# EAGLE design shirasu (EAGLE 9.6.2)
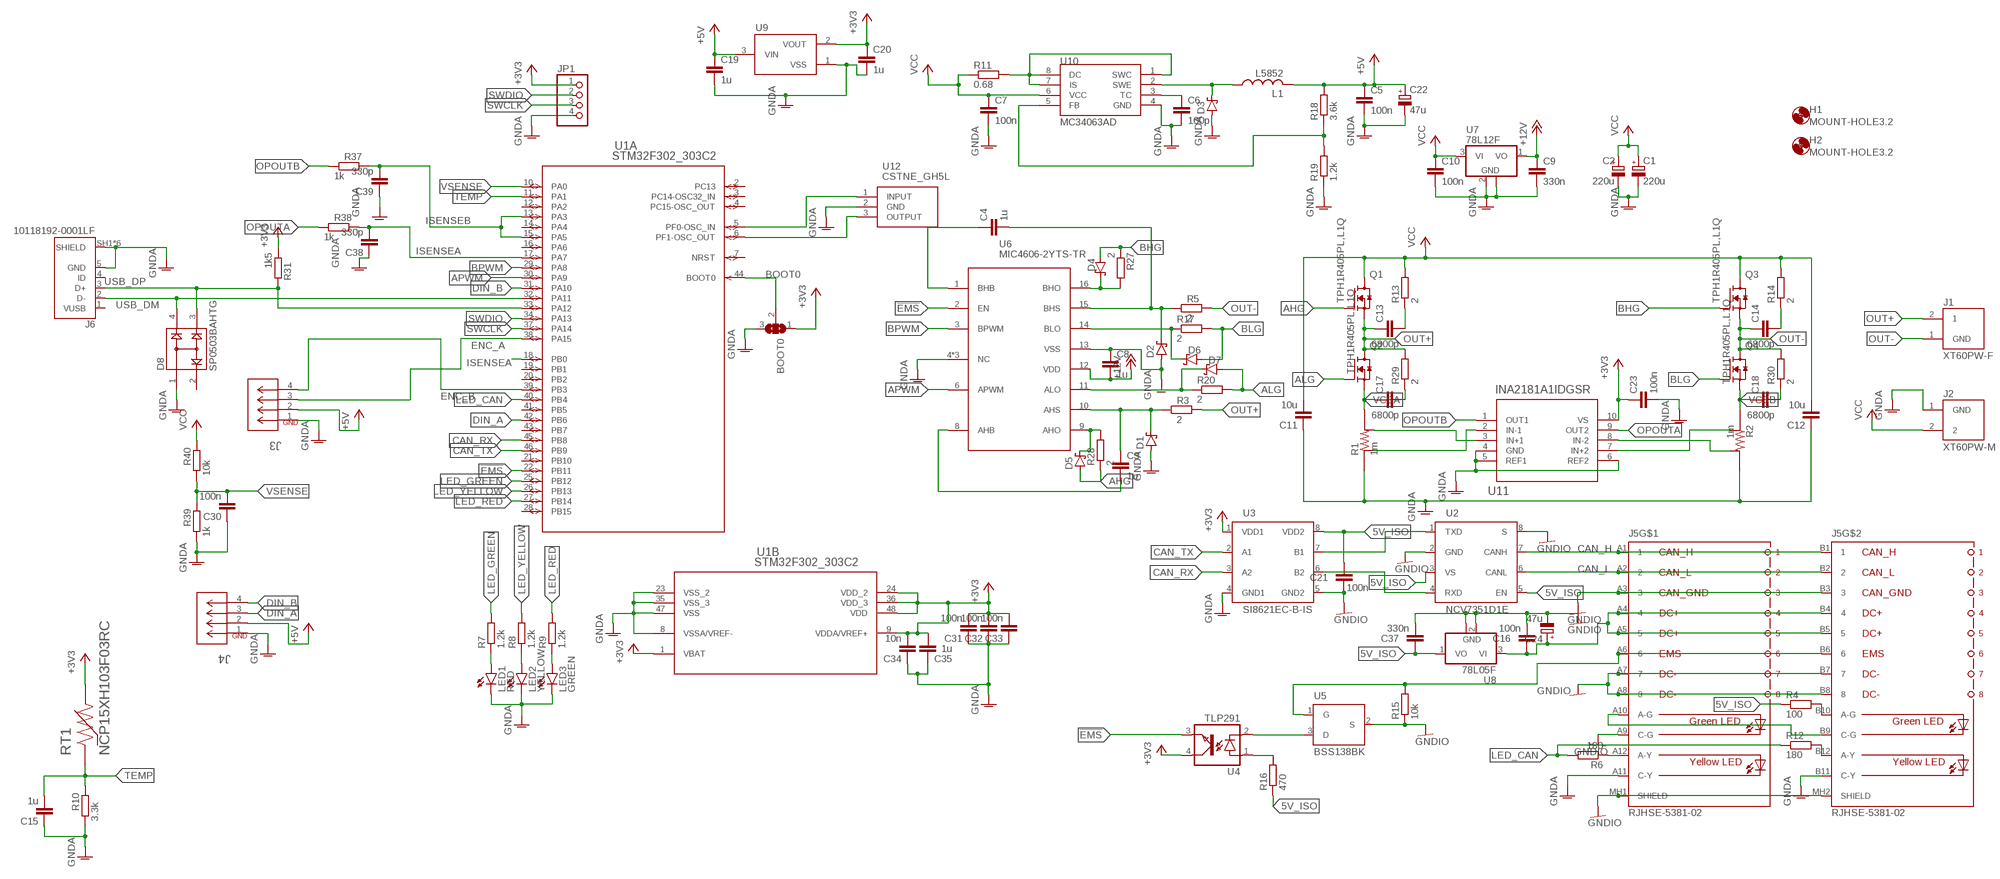
[diagram p0: schematic, sheet 1]

## Parts
BOOT0  SJ2W  [SJ_2]
C1  220u  CPOL-EUE5-10.5  [E5-10,5]
C2  220u  CPOL-EUE5-10.5  [E5-10,5]
C3  1u  C-EUC0603  [C0603]
C4  1u  C-EUC0603  [C0603]
C5  100n  C-EUC0603  [C0603]
C6  100p  C-EUC0603  [C0603]
C7  100n  C-EUC0603  [C0603]
C8  1u  C-EUC0603  [C0603]
C9  330n  C-EUC0603  [C0603]
C10  100n  C-EUC0603  [C0603]
C11  10u  C-EUC1210  [C1210]
C12  10u  C-EUC1210  [C1210]
C13  6800p  C-EUC0603  [C0603]
C14  6800p  C-EUC0603  [C0603]
C15  1u  C-EUC0603  [C0603]
C16  100n  C-EUC0603  [C0603]
C17  6800p  C-EUC0603  [C0603]
C18  6800p  C-EUC0603  [C0603]
C19  1u  C-EUC0603  [C0603]
C20  1u  C-EUC0603  [C0603]
C21  100n  C-EUC0603  [C0603]
C22  47u  CPOL-EUE2.5-5  [E2,5-5]
C23  100n  C-EUC0603  [C0603]
C24  47u  CPOL-EUE2.5-5  [E2,5-5]
C30  100n  C-EUC0603  [C0603]
C31  100n  C-EUC0603  [C0603]
C32  100n  C-EUC0603  [C0603]
C33  100n  C-EUC0603  [C0603]
C34  10n  C-EUC0603  [C0603]
C35  1u  C-EUC0603  [C0603]
C37  330n  C-EUC0603  [C0603]
C38  330p  C-EUC0603  [C0603]
C39  330p  C-EUC0603  [C0603]
D1  PMEG6010CEJ,115  [SOD323_ST]
D2  PMEG6010CEJ,115  [SOD323_ST]
D3  PMEG6010CEJ,115  [SOD323_ST]
D4  PMEG6010CEJ,115  [SOD323_ST]
D5  PMEG6010CEJ,115  [SOD323_ST]
D6  PMEG6010CEJ,115  [SOD323_ST]
D7  PMEG6010CEJ,115  [SOD323_ST]
D8  SP0503BAHTG  [SOT143]
H1  MOUNT-HOLE3.2  [3,2]
H2  MOUNT-HOLE3.2  [3,2]
J1  XT60PW-F  [AMASS_XT60PW-F]
J2  XT60PW-M  [AMASS_XT60PW-M]
J3  EP2.5-4-SIDE  [CONN4_1744426-4]
J4  EP2.5-4-SIDE  [CONN4_1744426-4]
J5  RJHSE-5381-02  [RJHSE538102]
J6  10118192-0001LF  [AMPHENOL_10118192-0001LF]
JP1  PINHD-1X4  [1X04]
L1  L5852  [L5852]
LED1  RED  LEDCHIP-LED0603  [CHIP-LED0603]
LED2  YELLOW  LEDCHIP-LED0603  [CHIP-LED0603]
LED3  GREEN  LEDCHIP-LED0603  [CHIP-LED0603]
Q1  TPH1R405PL,L1Q  [SOPADVANCE]
Q2  TPH1R405PL,L1Q  [SOPADVANCE]
Q3  TPH1R405PL,L1Q  [SOPADVANCE]
Q4  TPH1R405PL,L1Q  [SOPADVANCE]
R1  1m  R2512  [2512-4PAD]
R2  1m  R2512  [2512-4PAD]
R3  2  R-EU_R0603  [R0603]
R4  100  R-EU_R0603  [R0603]
R5  2  R-EU_R0603  [R0603]
R6  180  R-EU_R0603  [R0603]
R7  1.2k  R-EU_R0603  [R0603]
R8  1.2k  R-EU_R0603  [R0603]
R9  1.2k  R-EU_R0603  [R0603]
R10  3.3k  R-EU_R0603  [R0603]
R11  0.68  R-EU_R1206  [R1206]
R12  180  R-EU_R0603  [R0603]
R13  2  R-EU_R0603  [R0603]
R14  2  R-EU_R0603  [R0603]
R15  10k  R-EU_R0603  [R0603]
R16  470  R-EU_R0603  [R0603]
R17  2  R-EU_R0603  [R0603]
R18  3.6k  R-EU_R0603  [R0603]
R19  1.2k  R-EU_R0603  [R0603]
R20  2  R-EU_R0603  [R0603]
R27  2  R-EU_R0603  [R0603]
R28  2  R-EU_R0603  [R0603]
R29  2  R-EU_R0603  [R0603]
R30  2  R-EU_R0603  [R0603]
R31  1k5  R-EU_R0603  [R0603]
R37  1k  R-EU_R0603  [R0603]
R38  1k  R-EU_R0603  [R0603]
R39  1k  R-EU_R0603  [R0603]
R40  10k  R-EU_R0603  [R0603]
RT1  NCP15XH103F03RC  [THRMC1005X55N]
U1  STM32F302_303C2  [LQFP48-7X7MM]
U2  NCV7351D1E  [SO08]
U3  SI8621EC-B-IS  [SO08]
U4  TLP291  [MINI-FLAT-4]
U5  BSS138BK  [SOT23]
U6  MIC4606-2YTS-TR  [TSSOP16]
U7  78L12F  [SOT89]
U8  78L05F  [SOT89]
U9  XC6206  [SOT95P240X110-3]
U10  MC34063AD  [SOIC8]
U11  INA2181A1IDGSR  [DGS10]
U12  CSTNE_GH5L  [CSTNE_GH5L]

## Nets
5V_ISO: C21.2 C37.1 R4.1 R16.1 U2.3(VS) U2.5(EN) U3.8(VDD2) U8.1(VO)
!EMS: U1.22(A:PB11) U4.3(EMIT) U6.2(EN)
+3V3: BOOT0.1 C20.1 C23.1 C31.2 C32.2 C33.2 C34.2 C35.2 JP1.1 R31.1 RT1.2 U1.1(B:VBAT) U1.9(B:VDDA/VREF+) U1.24(B:VDD_2) U1.36(B:VDD_3) U1.48(B:VDD) U3.1(VDD1) U4.4(COL) U9.2(VOUT) U11.10(VS)
+5V: C5.1 C19.1 C22.+ J3.2 J4.2 L1.P$2 R18.2 U9.3(VIN)
+12V: C8.2 C9.1 U6.12(VDD) U7.1(VO)
AHG: D5.A Q1.4(G) R28.1
ALG: D7.A Q2.4(G) R20.2
APWM: U1.30(A:PA9) U6.6(APWM)
BHG: D4.A Q3.4(G) R27.1
BLG: D6.A Q4.4(G) R17.2
BOOT0: BOOT0.2 U1.44(A:BOOT0)
BPWM: U1.29(A:PA8) U6.3(BPWM)
CAN_H: J5.A1 J5.B1 U2.7(CANH)
CAN_L: J5.A2 J5.B2 U2.6(CANL)
CAN_RX: U1.45(A:PB8) U3.3(A2)
CAN_TX: U1.46(A:PB9) U3.2(A1)
DIN_A: J4.3 U1.42(A:PB6)
DIN_B: J4.4 U1.31(A:PA10)
ENC_A: J3.3 U1.38(A:PA15)
ENC_B: J3.4 U1.39(A:PB3)
GNDA: BOOT0.3 C1.- C2.- C5.2 C6.2 C7.2 C8.1 C9.2 C10.2 C11.1 C12.1 C15.1 C19.2 C20.2 C22.- C23.2 C30.1 C31.1 C32.1 C33.1 C34.1 C35.1 C38.1 C39.1 D1.A D2.A D3.A D8.1 J2.1(GND) J3.1 J4.1 J5.A11(C-Y) J5.B11(C-Y) J6.5(GND) J6.SH1(SHIELD) J6.SH2(SHIELD) J6.SH3(SHIELD) J6.SH4(SHIELD) J6.SH5(SHIELD) J6.SH6(SHIELD) JP1.4 LED1.C LED2.C LED3.C R1.1 R1.2 R2.3 R2.4 R10.1 R19.1 R39.1 U1.8(B:VSSA/VREF-) U1.23(B:VSS_2) U1.35(B:VSS_3) U1.47(B:VSS) U3.4(GND1) U6.4(NC) U6.5(NC) U6.7(NC) U6.13(VSS) U7.2(GND) U7.2@1(GND) U9.1(VSS) U10.4(GND) U11.4(GND) U11.5(REF1) U11.6(REF2) U12.2(GND)
GNDIO: C16.2 C21.1 C24.- C37.2 J5.A3 J5.A7 J5.A8 J5.A9(C-G) J5.B3 J5.B7 J5.B8 J5.MH1(SHIELD) J5.MH2(SHIELD) R15.1 U2.2(GND) U2.8(S) U3.5(GND2) U5.2(S) U8.2(GND) U8.2@1(GND)
ISENSEA: C38.2 R38.2 U1.17(A:PA7) U1.18(A:PB0)
ISENSEB: C39.2 R37.2 U1.13(A:PA3) U1.15(A:PA5)
LED_CAN: R6.2 R12.1 U1.40(A:PB4)
LED_GREEN: R7.2 U1.25(A:PB12)
LED_RED: R9.2 U1.27(A:PB14)
LED_YELLOW: R8.2 U1.26(A:PB13)
N$1: C17.2 R29.1
N$2: C18.2 R30.1
N$3: C3.1 D1.C R3.1 U6.10(AHS)
N$4: C3.2 U6.8(AHB)
N$5: C4.2 D2.C R5.1 U6.15(BHS)
N$6: J5.B10(A-G) R4.2
N$7: J5.A10(A-G) J5.B9(C-G)
N$8: C4.1 U6.1(BHB)
N$9: LED1.A R7.1
N$10: LED2.A R8.1
N$11: LED3.A R9.1
N$12: J5.A12(A-Y) R6.1
N$13: J5.B12(A-Y) R12.2
N$14: U2.1(TXD) U3.7(B1)
N$15: C16.1 C24.+ J5.A4 J5.A5 J5.B4 J5.B5 U8.3(VI)
N$16: U2.4(RXD) U3.6(B2)
N$17: J5.A6 J5.B6 R15.2 U5.1(G)
N$18: C14.2 R14.1
N$19: D6.C R17.1 U6.14(BLO)
N$20: C13.2 R13.1
N$21: D7.C R20.1 U6.11(ALO)
N$22: R1.6 U11.3(IN+1)
N$23: R2.5 U11.7(IN+2)
N$24: U4.2(C) U5.3(D)
N$25: R16.2 U4.1(A)
N$26: D3.C L1.P$1 U10.2(SWE)
N$27: C6.1 U10.3(TC)
N$28: R18.1 R19.2 U10.5(FB)
N$29: R2.6 U11.8(IN-2)
N$30: R11.2 U10.1(SWC) U10.7(IS) U10.8(DC)
N$31: R1.5 U11.2(IN-1)
N$32: D4.C R27.2 U6.16(BHO)
N$33: D5.C R28.2 U6.9(AHO)
N$34: U1.5(A:PF0-OSC_IN) U12.1(INPUT)
N$35: U1.6(A:PF1-OSC_OUT) U12.3(OUTPUT)
OPOUTA: R38.1 U11.9(OUT2)
OPOUTB: R37.1 U11.1(OUT1)
OUT+: C13.1 J1.2 Q1.1(S) Q1.2(S) Q1.3(S) Q2.5(D) Q2.6(D) Q2.7(D) Q2.8(D) Q2.9(D) R3.2 R29.2
OUT-: C14.1 J1.1(GND) Q3.1(S) Q3.2(S) Q3.3(S) Q4.5(D) Q4.6(D) Q4.7(D) Q4.8(D) Q4.9(D) R5.2 R30.2
SWCLK: JP1.3 U1.37(A:PA14)
SWDIO: JP1.2 U1.34(A:PA13)
TEMP: C15.2 R10.2 RT1.1 U1.11(A:PA1)
USB_DM: D8.4 J6.2(D-) U1.32(A:PA11)
USB_DP: D8.3 J6.3(D+) R31.2 U1.33(A:PA12)
VCC: C1.+ C2.+ C7.1 C10.1 C11.2 C12.2 J2.2 Q1.5(D) Q1.6(D) Q1.7(D) Q1.8(D) Q1.9(D) Q3.5(D) Q3.6(D) Q3.7(D) Q3.8(D) Q3.9(D) R11.1 R13.2 R14.2 R40.2 U7.3(VI) U10.6(VCC)
VCSA: C17.1 Q2.1(S) Q2.2(S) Q2.3(S) R1.3 R1.4
VCSB: C18.1 Q4.1(S) Q4.2(S) Q4.3(S) R2.1 R2.2
VSENSE: C30.2 R39.2 R40.1 U1.10(A:PA0)
Unconnected: D8.2 J6.1(VUSB) J6.4(ID) U1.2(A:PC13) U1.3(A:PC14-OSC32_IN) U1.4(A:PC15-OSC_OUT) U1.7(A:NRST) U1.12(A:PA2) U1.14(A:PA4) U1.16(A:PA6) U1.19(A:PB1) U1.20(A:PB2) U1.21(A:PB10) U1.28(A:PB15) U1.41(A:PB5) U1.43(A:PB7)

## Library data of the parts
BOOT0 = jumper:SJ2W: SMD solder JUMPER
C1 C2 C22 C24 = rcl:CPOL-EU: POLARIZED CAPACITOR, European symbol; SPICEPREFIX: C
C3-C21 C23 C30-C35 C37-C39 = rcl:C-EU: CAPACITOR, European symbol; SPICEPREFIX: C
D1-D7 = nexperia:PMEG6010CEJ,115: Schottky barrier diode
D8 = Littelfuse:SP0503BAHTG: TVS DIODE 5.5VWM 8.5VC SOT143; DESCRIPTION: 8.5V Clamp Ipp Tvs Diode Surface Mount SOT-143-4; DIGI-KEY_PART_NUMBER: F2715CT-ND; DIGI-KEY_PURCHASE_URL: https://www.digikey.com/product-detail/en/littelfuse-inc/SP0503BAHTG/F2715CT-ND/1154322?utm_source=snapeda&utm_medium=aggregator&utm_campaign=symbol; MF: Littelfuse Inc.; MP: SP0503BAHTG; PACKAGE: SOT-143 Littelfuse
H1 H2 = holes:MOUNT-HOLE: MOUNTING HOLE with drill center marker
J1 = con-xt:XT60PW-F
J2 = con-xt:XT60PW-M; AVAILABILITY: Unavailable; MF: AMASS; MP: XT60PW-M; PACKAGE: Package Analog Devices; PRICE: None
J3 J4 = con-ep2.5:EP2.5-4-SIDE; MANUFACTURER_PART_NUMBER: 17444264; VENDOR: TE Connectivity
J5 = con-rj45:RJHSE-5381-02: Modular Connectors / Ethernet Connectors R/A RJ45 SHEILDED 2 PORT Y/G LEDS Source: Datasheet <https://componentsearchengine.com/Datasheets/1/RJHSE-5381-02.pdf>; DESCRIPTION: Modular Connectors / Ethernet Connectors R/A RJ45 SHEILDED 2 PORT Y/G LEDS; HEIGHT: 13.46mm; MANUFACTURER_NAME: Amphenol; MANUFACTURER_PART_NUMBER: RJHSE-5381-02; MOUSER_PART_NUMBER: 523-RJHSE-5381-02; MOUSER_PRICE-STOCK: https://www.mouser.com/Search/Refine.aspx?Keyword=523-RJHSE-5381-02
J6 = con-usb:10118192-0001LF: Single Port 5 Contact Horizontal Right Angle Shielded Micro B USB 2.0 Connector; DESCRIPTION: USB - micro B USB 2.0 Receptacle Connector 5 Position Surface Mount, Right Angle; DIGI-KEY_PART_NUMBER: 609-4613-1-ND; DIGI-KEY_PURCHASE_URL: https://www.digikey.com/product-detail/en/amphenol-icc-fci/10118192-0001LF/609-4613-1-ND/2785378?utm_source=snapeda&utm_medium=aggregator&utm_campaign=symbol; MF: Amphenol ICC; MP: 10118192-0001LF; PACKAGE: None
JP1 = pinhead:PINHD-1X4: PIN HEADER
L1 = inductors:L5852
LED1-LED3 = led:LED: LED OSRAM: - CHIPLED LG R971, LG N971, LY N971, LG Q971, LY Q971, LO R971, LY R971 LH N974, LH R974 LS Q976, LO Q976, LY Q976 LO Q996 - Hyper CHIPLED LW Q18S LB Q993, LB Q99A, LB R99A - SideLED LS A670, LO A670, LY A670, LG A670, LP A670 LB A673, LV A673, LT A673, LW A673 LH A674 LY A675 LS A676, LA A676, LO A676, LY A676, LW A676 LS A679, LY A679, LG A679 - Hyper Micro SIDELED® LS Y876, LA Y876, LO Y876, LY Y876 LT Y87S - SmartLED LW L88C, LW L88S LB L89C, LB L89S, LG L890 LS L89K, LO L89K, LY L89K LS L896, LA L896, LO L896, LY L896 - TOPLED LS T670, LO T670, LY T670, LG T670, LP T670 LSG T670, LSP T670, LSY T670, LOP T670, LYG T670 LG T671, LOG T671, LSG T671 LB T673, LV T673, LT T673, LW T673 LH T674 LS T676, LA T676, LO T676, LY T676, LB T676, LH T676, LSB T676, LW T676 LB T67C, LV T67C, LT T67C, LS T67K, LO T67K, LY T67K, LW E67C LS E67B, LA E67B, LO E67B, LY E67B, LB E67C, LV E67C, LT E67C LW T67C LS T679, LY T679, LG T679 LS T770, LO T770, LY T770, LG T770, LP T770 LB T773, LV T773, LT T773, LW T773 LH T774 LS E675, LA E675, LY E675, LS T675 LS T776, LA T776, LO T776, LY T776, LB T776 LHGB T686 LT T68C, LB T68C - Hyper Mini TOPLED® LB M676 - Mini TOPLED Santana® LG M470 LS M47K, LO M47K, LY M47K Source: http://www.osram.convergy.de LUXEON: - LUMILED® LXK2-PW12-R00, LXK2-PW12-S00, LXK2-PW14-U00, LXK2-PW14-V00 LXK2-PM12-R00, LXK2-PM12-S00, LXK2-PM14-U00 LXK2-PE12-Q00, LXK2-PE12-R00, LXK2-PE12-S00, LXK2-PE14-T00, LXK2-PE14-U00 LXK2-PB12-K00, LXK2-PB12-L00, LXK2-PB12-M00, LXK2-PB14-N00, LXK2-PB14-P00, LXK2-PB14-Q00 LXK2-PR12-L00, LXK2-PR12-M00, LXK2-PR14-Q00, LXK2-PR14-R00 LXK2-PD12-Q00, LXK2-PD12-R00, LXK2-PD12-S00 LXK2-PH12-R00, LXK2-PH12-S00 LXK2-PL12-P00, LXK2-PL12-Q00, LXK2-PL12-R00 Source: www.luxeon.com KINGBRIGHT: KA-3528ASYC Source: www.kingbright.com
Q1-Q4 = toshiba:TPH1R405PL,L1Q
R1 R2 = shunt-resistor:R2512
R3-R20 R27-R31 R37-R40 = rcl:R-EU_: RESISTOR, European symbol; SPICEPREFIX: R
RT1 = NCP15XH103F03RC:NCP15XH103F03RC: NTC Thermistor 10k 0402 (1005 Metric) Check prices <https://pricing.snapeda.com/parts/NCP15XH103F03RC/Murata/view-part?ref=eda>; AVAILABILITY: Good; DESCRIPTION: NTC Thermistor 10k 0402 (1005 Metric); MF: Murata; MP: NCP15XH103F03RC; PACKAGE: 1005 Taiyo Yuden; PRICE: None; PURCHASE-URL: https://pricing.snapeda.com/search/part/NCP15XH103F03RC/?ref=eda
U1 = stm32_mcu:STM32F302_303C2; COPYRIGHT: Copyright (C) 2016 Accelerated Designs. All rights reserved; MANUFACTURER_PART_NUMBER: STM32F302_303C2; VENDOR: STMicroelectronics
U2 = on-semi:NCV7351D1E: High Speed CAN Transceiver Source: NCV7351-D.PDF <http://www.onsemi.com/PowerSolutions/document/NCV7351-D.PDF>
U3 = silicon-labs:SI8621EC-B-IS: 1 Mbps Digital Isolator 1 Mbps, 2.5 kVRMS Digital Isolator Source: Si86xx.pdf <https://www.silabs.com/documents/public/data-sheets/Si86xx.pdf>
U4 = toshiba:TLP291: TOSHIBA PHOTOCOUPLER GaAs IRED & PHOTO-TRANSISTOR; OC_FARNELL: unknown; OC_NEWARK: unknown
U5 = nexperia:BSS138BK: BSS138BK MOSFET https://jp.rs-online.com/web/p/mosfets/7920894/ Source: Data sheet <https://docs-apac.rs-online.com/webdocs/1270/0900766b81270fbc.pdf>; MPN: BSS138BK,215
U6 = Microchip:MIC4606-2YTS-TR
U7 U8 = linear:78L*: POSITOIV-VOLTAGE REGULATORS Output up to 100 mA Source: Datasheet <http://focus.ti.com/lit/ds/symlink/ua78l05.pdf>
U9 = torex:XC6206
U10 = mc34063:MC34063
U11 = texas-instruments:INA2181A1IDGSR; BUILT_BY: EMA_Jessica; COPYRIGHT: Copyright (C) 2018 Accelerated Designs. All rights reserved; MANUFACTURER_PART_NUMBER: INA2181A1IDGSR; VENDOR: Texas Instruments
U12 = resonator:CSTNE_GH5L: Resonators 8.0000MHz 33pF SMD CHP Resntr Tol 0.07% Source: Datasheet <https://componentsearchengine.com/Datasheets/1/CSTNE8M00GH5L000R0.pdf>; DESCRIPTION: Resonators 8.0000MHz 33pF SMD CHP Resntr Tol 0.07%; HEIGHT: 1mm; MANUFACTURER_NAME: Murata Electronics; MANUFACTURER_PART_NUMBER: CSTNE8M00GH5L000R0; MOUSER_PART_NUMBER: 81-CSTNE8M00GH5L000R; MOUSER_PRICE-STOCK: https://www.mouser.com/Search/Refine.aspx?Keyword=81-CSTNE8M00GH5L000R

## Board
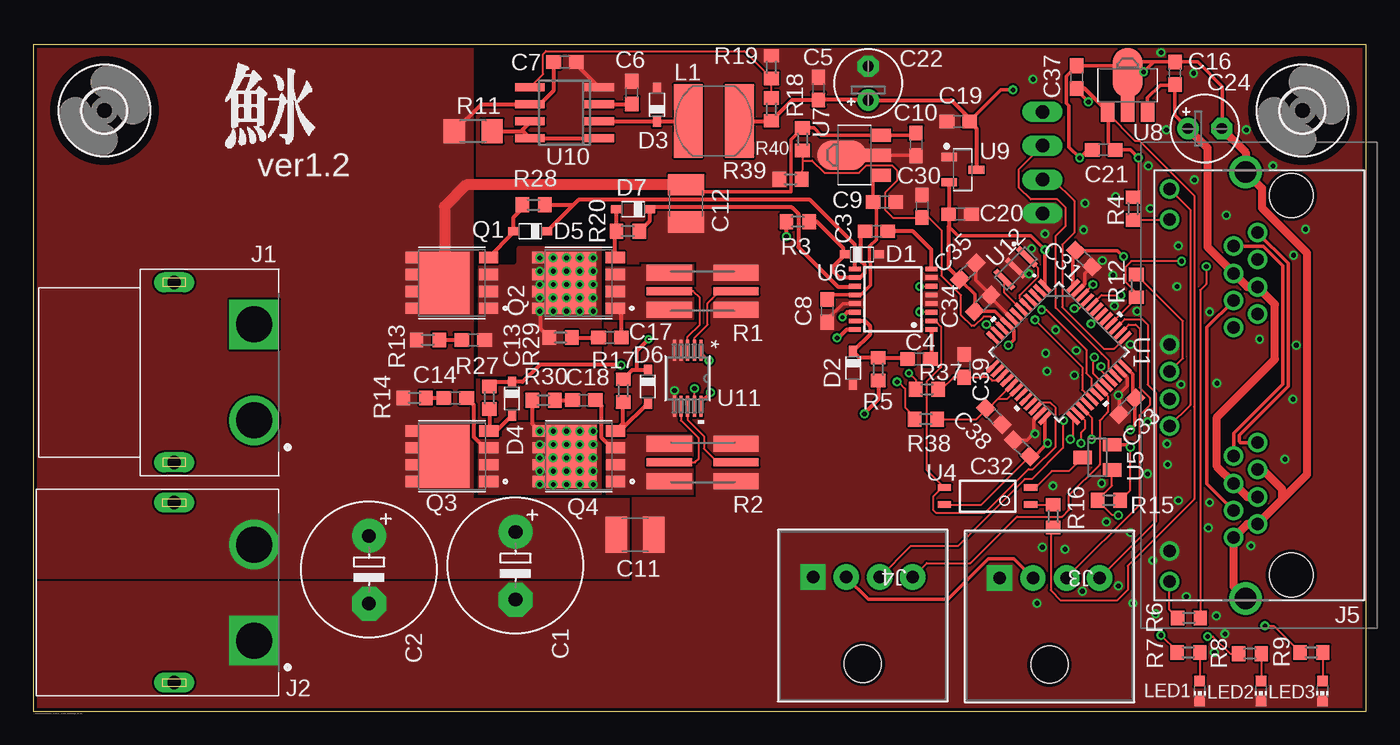
[diagram p1: board, top side]
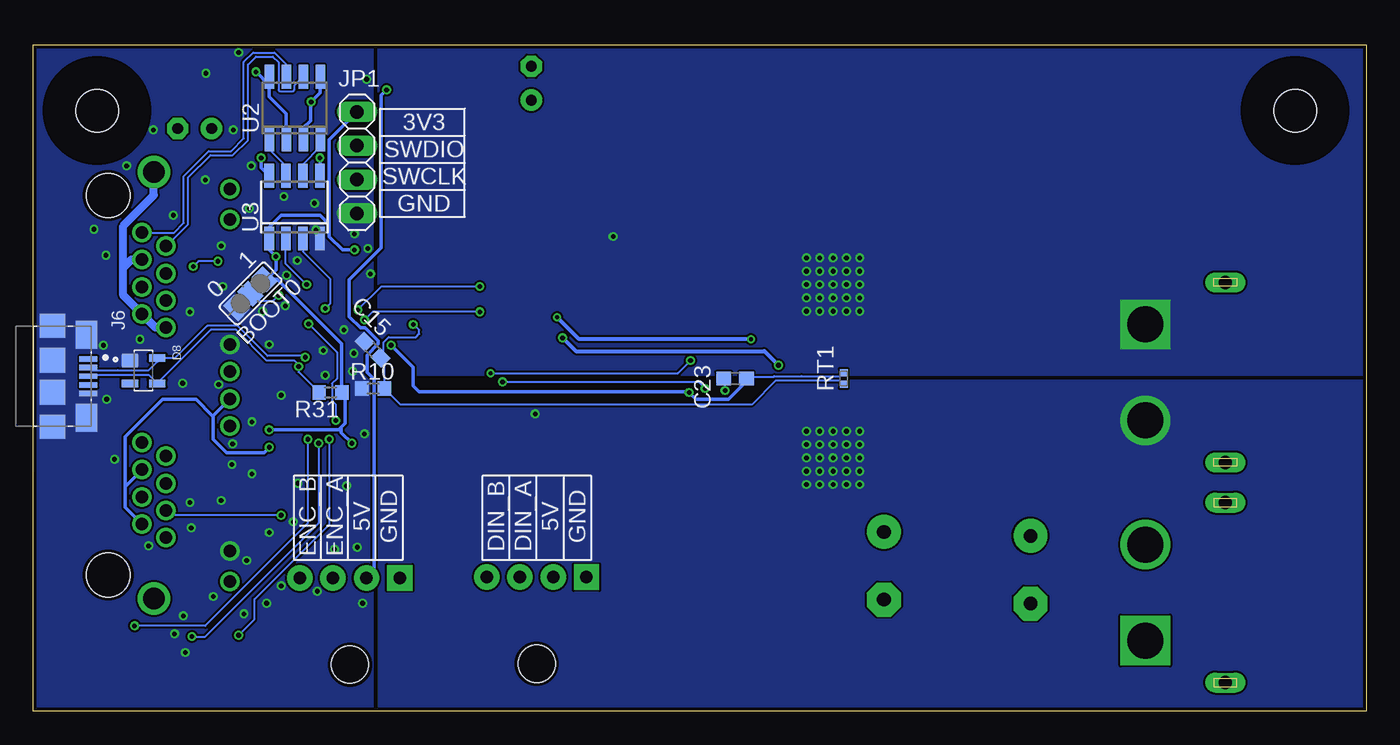
[diagram p2: board, bottom side, seen from below]

Size 100 x 50 mm. Coordinates in mm from the lower left corner, seen from the top.
Outline: 0,0 100,0 100,50 0,50 0,0
Copper layers (1*16): Top 0.035mm / dielectric 1.5mm / Bottom 0.035mm
Design rules "myrule": minimum track width 6mil, minimum drill 12mil, track to track 6mil, track to pad 6mil, pad to pad 6mil, via to via 6mil, smd to smd 0mil, copper to edge 10mil, drill to drill 10mil, minimum pad ring 10mil, minimum via ring 6mil, stop-mask expansion 2mil, vias tented up to drill 0.4mm, thermal gap 10mil

### Footprints (pad centres in the part's own frame; a part is rotated, then mirrored left to right if it is on the bottom)
SJ_2 = smd 1.168 x 1.6: 1 -1.524,0; 2 0,0; 3 1.524,0
E5-10,5 = drill 1.016 pad 2.54: + -2.54,0 | drill 1.016 pad 2.54 octagon: - 2.54,0
C0603 = smd 1.1 x 1: 1 -0.85,0; 2 0.85,0
C1210 = smd 1.6 x 2.7: 1 -1.4,0; 2 1.4,0
E2,5-5 = drill 0.813 pad 1.6: + -1.27,0 | drill 0.813 pad 1.6 octagon: - 1.27,0
SOD323_ST = smd 0.8 x 0.6: A 1.25,0; C -1.25,0
SOT143 = smd 0.99 x 1.3: 1 -0.76,-1.025 | smd 0.59 x 1.3: 2 0.96,-1.025; 3 0.96,1.025; 4 -0.96,1.025
3,2 = hole 3.2: 0,0
AMASS_XT60PW-F = drill 2.7: 1 -3.6,-6 | drill 2.7 square: 2 3.6,-6 | drill 1 pad 1.2 long: S1 -6.75,0; S2 6.75,0
AMASS_XT60PW-M = drill 2.7 square: 1 -3.6,-6 | drill 2.7: 2 3.6,-6 | drill 1 pad 1.2 long: S1 -6.75,0; S2 6.75,0
CONN4_1744426-4 = drill 0.94 pad 1.905 square: 1 7.493,0 | drill 0.94 pad 1.905: 2 5.004,0; 3 2.489,0; 4 0,0 | hole 2.794: 3.759,6.502
RJHSE538102 = drill 0.94 pad 1.462: A1 0,0; A2 -1.02,1.78; A3 -2.04,0; A4 -3.06,1.78; A5 -4.08,0; A6 -5.1,1.78; A7 -6.12,0; A8 -7.14,1.78; A9 3.28,6.6; A10 1.25,6.6; A11 -8.15,6.6; A12 -10.44,6.6; B1 15.75,0; B2 14.73,1.78; B3 13.71,0; B4 12.69,1.78; B5 11.67,0; B6 10.65,1.78; B7 9.63,0; B8 8.61,1.78; B9 19.03,6.6; B10 16.74,6.6; B11 7.34,6.6; B12 5.31,6.6 | drill 1.62 pad 2.43: MH1 -11.705,0.89; MH2 20.295,0.89 | hole 3.3: -9.93,-2.54; 18.52,-2.54
AMPHENOL_10118192-0001LF = smd 0.4 x 1.35: 1 -1.3,0; 2 -0.65,0; 3 0,0; 4 0.65,0; 5 1.3,0 | smd 2.1 x 1.6: SH1 -3.1,-0.125; SH2 3.1,-0.125 | smd 1.8 x 1.9: SH3 -3.8,-2.675; SH6 3.8,-2.675 | smd 1.9 x 1.9: SH4 -1.2,-2.675; SH5 1.2,-2.675
1X04 = drill 1.016 long: 1 -3.81,0; 2 -1.27,0; 3 1.27,0; 4 3.81,0
L5852 = smd 2.15 x 5.5: P$1 1.925,0; P$2 -1.925,0
CHIP-LED0603 = smd 0.8 x 0.8: A 0,-0.75; C 0,0.75
SOPADVANCE = smd 1.45 x 0.85: 1 -2.75,1.905; 2 -2.75,0.635; 3 -2.75,-0.635; 4 -2.75,-1.905 | smd 1.05 x 0.85: 5 2.95,-1.905; 6 2.95,-0.635; 7 2.95,0.635; 8 2.95,1.905 | smd 3.75 x 4.7: 9 0.55,0
2512-4PAD = smd 3.4 x 1.2: 1 -2.5,1.4; 2 -2.5,-1.4; 3 2.5,1.4; 4 2.5,-1.4 | smd 3.4 x 0.6: 5 -2.5,0; 6 2.5,0
R0603 = smd 1 x 1.1: 1 -0.85,0; 2 0.85,0
R1206 = smd 1.6 x 1.803: 1 -1.422,0; 2 1.422,0
THRMC1005X55N = smd 0.54 x 0.6: 1 -0.432,0; 2 0.432,0
LQFP48-7X7MM = smd 1.194 x 0.305: 1 -4.25,2.75; 2 -4.25,2.25; 3 -4.25,1.75; 4 -4.25,1.25; 5 -4.25,0.75; 6 -4.25,0.25; 7 -4.25,-0.25; 8 -4.25,-0.75; 9 -4.25,-1.25; 10 -4.25,-1.75; 11 -4.25,-2.25; 12 -4.25,-2.75; 25 4.25,-2.75; 26 4.25,-2.25; 27 4.25,-1.75; 28 4.25,-1.25; 29 4.25,-0.75; 30 4.25,-0.25; 31 4.25,0.25; 32 4.25,0.75; 33 4.25,1.25; 34 4.25,1.75; 35 4.25,2.25; 36 4.25,2.75 | smd 0.305 x 1.194: 13 -2.75,-4.25; 14 -2.25,-4.25; 15 -1.75,-4.25; 16 -1.25,-4.25; 17 -0.75,-4.25; 18 -0.25,-4.25; 19 0.25,-4.25; 20 0.75,-4.25; 21 1.25,-4.25; 22 1.75,-4.25; 23 2.25,-4.25; 24 2.75,-4.25; 37 2.75,4.25; 38 2.25,4.25; 39 1.75,4.25; 40 1.25,4.25; 41 0.75,4.25; 42 0.25,4.25; 43 -0.25,4.25; 44 -0.75,4.25; 45 -1.25,4.25; 46 -1.75,4.25; 47 -2.25,4.25; 48 -2.75,4.25
SO08 = smd 0.72 x 1.78: 1 -1.905,-2.35; 2 -0.635,-2.35; 3 0.635,-2.35; 4 1.905,-2.35; 5 1.905,2.35; 6 0.635,2.35; 7 -0.635,2.35; 8 -1.905,2.35
MINI-FLAT-4 = smd 1 x 0.5: 1 -3.24,0.635; 2 -3.24,-0.635; 3 3.24,-0.635; 4 3.24,0.635
SOT23 = smd 1 x 1.4: 1 -0.95,-1.1; 2 0.95,-1.1; 3 0,1.1
TSSOP16 = smd 0.9 x 0.35: 1 -2.875,2.275; 2 -2.875,1.625; 3 -2.875,0.975; 4 -2.875,0.325; 5 -2.875,-0.325; 6 -2.875,-0.975; 7 -2.875,-1.625; 8 -2.875,-2.275; 9 2.875,-2.275; 10 2.875,-1.625; 11 2.875,-0.975; 12 2.875,-0.325; 13 2.875,0.325; 14 2.875,0.975; 15 2.875,1.625; 16 2.875,2.275
SOT89 = smd 1 x 1.5: 1 -1.499,-1.981; 3 1.499,-1.981 | smd 1 x 2: 2 0,-1.727 | smd 2.2 x 3.7: 2@1 0,0.94
SOT95P240X110-3 = smd 1.18 x 0.609: 1 -1.024,0.95; 2 -1.024,-0.95; 3 1.024,0
SOIC8 = smd 0.6 x 2.2: 1 -1.905,-2.6; 2 -0.635,-2.6; 3 0.635,-2.6; 4 1.905,-2.6; 5 1.905,2.6; 6 0.635,2.6; 7 -0.635,2.6; 8 -1.905,2.6
DGS10 = smd 1.575 x 0.229: 1 -2.095,1; 2 -2.095,0.5; 3 -2.095,0; 4 -2.095,-0.5; 5 -2.095,-1; 6 2.095,-1; 7 2.095,-0.5; 8 2.095,0; 9 2.095,0.5; 10 2.095,1
CSTNE_GH5L = smd 0.4 x 1.9: 1 -1.2,0; 2 0,0; 3 1.2,0

### Placement (x,y rotation side)
BOOT0  83.71,31.32 225 bottom
C1  36.18,10.91 270 top
C2  25.18,10.61 270 top
C3  63.26,35.99 0 top
C4  66.45,26.41 180 top
C5  58.91,46.7 90 top
C6  44.91,46.39 90 top
C7  39.88,48.69 0 top
C8  59.56,30.02 90 top
C9  63.86,38.19 0 top
C10  66.22,42.51 270 top
C11  45.14,13.23 180 top
C12  48.98,38.08 90 top
C13  33,27.85 180 top
C14  31.65,23.5 180 top
C15  74.55,27.1 315 bottom
C16  85.65,47.85 90 top
C17  43.25,28.02 180 top
C18  41.31,23.33 180 top
C19  69.39,44.23 180 top
C20  69.53,37.27 0 top
C21  80.3,42.1 0 top
C22  62.64,47.1 90 top
C23  47.35,24.95 180 bottom
C24  87.9,43.7 0 top
C30  66.67,37.87 270 top
C31  78.83,33.95 135 top
C32  74.17,19.73 315 top
C33  82.09,22.87 45 top
C34  71.23,30.59 225 top
C35  70.11,32.99 225 top
C37  78.28,47.56 90 top
C38  72.07,22.13 135 top
C39  69.83,25.9 270 top
D1  62.17,34.26 0 top
D2  61.51,25.74 270 top
D3  46.79,45.48 90 top
D4  35.91,23.45 270 top
D5  37.28,35.99 180 top
D6  46.1,24.35 270 top
D7  45,37.65 180 top
D8  91.73,25.54 270 bottom
H1  95.22,45.04 0 top
H2  5.33,45.04 0 top
J1  10.57,25.41 90 top
J2  10.57,8.9 90 top
J3  80,10 180 top
J4  65.99,10.06 180 top
J5  91.84,20.15 90 top
J6  95.88,25.12 270 bottom
JP1  75.71,41.14 270 bottom
L1  51.05,44.26 180 top
LED1  87.5,1.51 180 top
LED2  92.11,1.51 180 top
LED3  96.72,1.51 180 top
Q1  31.4,32.12 180 top
Q2  40.91,32.12 180 top
Q3  31.42,19.12 180 top
Q4  40.93,19.12 180 top
R1  50.22,31.5 180 top
R2  50.22,18.66 0 top
R3  57.35,36.71 180 top
R4  82.5,37.7 270 top
R5  63.4,25.66 270 top
R6  86.7,7 0 top
R7  86.67,4.41 180 top
R8  91.28,4.31 180 top
R9  95.89,4.41 180 top
R10  74.5,24.2 0 bottom
R11  33,43.5 0 top
R12  82.75,31.9 90 top
R13  29.6,27.85 180 top
R14  28.6,23.5 180 top
R15  80.69,15.82 180 top
R16  76.52,14.63 90 top
R17  44.25,24.05 270 top
R18  55.38,45.13 270 top
R19  55.38,48.31 270 top
R20  44.6,36 180 top
R27  34.22,23.51 90 top
R28  37.53,37.98 0 top
R29  39.55,28.02 180 top
R30  38.28,23.32 180 top
R31  77.71,23.91 180 bottom
R37  67.05,24.14 0 top
R38  66.97,21.9 0 top
R39  56.81,39.89 0 top
R40  57.71,42.89 90 top
RT1  39.2,24.95 90 bottom
U1  76.95,26.94 315 top
U2  80.38,45.24 0 bottom
U3  80.4,37.81 0 bottom
U4  71.59,16.13 180 top
U5  79.83,19.03 90 top
U6  64.5,30.9 180 top
U7  61.6,41.7 90 top
U8  82.1,46.95 0 top
U9  69.73,40.61 0 top
U10  39.86,44.89 90 top
U11  49.09,24.96 270 top
U12  73.7,33.23 225 top

### Tracks (layer width: path | path; a pad name or v marks a point on that pad's centre or on a via)
5V_ISO  (via drill 0.35)
  Top 0.152: v82.9,41.5 82.9,38.95 R4.1 | U8.1 80.6,44.84 82.65,42.79 82.99,42.79 87.11,38.67 87.11,22.83 87.1,22.83 87.1,15.9 82.1,10.9 82.1,9.1 81.3,8.3 77.1,8.3 76.33,9.07 76.33,13.59 R16.1
  Top 0.254: v82.9,41.5 82.3,42.1 C21.2 80.65,42.6 80.65,44.92 U8.1 | C37.1 78.28,46.57 v79.15,45.7
  Top 0.305: U8.1 78.86,46.71 C37.1
  Bottom 0.254: U3.8 82.9,40.76 v82.9,41.5 | U2.5 78.47,46.38 v79.15,45.7 79.2,45.65 79.2,44.3 79.75,43.76 U2.3
!EMS
  Top 0.152: U6.2 67.42,29.23 67.72,29.23 68.1,28.85 68.1,25.79 67.01,24.7 67.01,18.11 U4.3 68.17,16.77 67.5,16.1 67.5,15.1 67.7,14.9 71.4,14.9 74.66,18.16 75.01,18.16 76.7,19.85 76.7,22.75 76.3,23.15 75.64,23.15 U1.22
+3V3  (via drill 0.35)
  Top 0.152: U4.4 71.14,15.5 C32.2
  Top 0.254: U1.48 78.01,34.33 C31.2 81.35,34.55 v81.8,34.1 | C35.2 69.65,32.25 70.63,31.27 C34.2 72.13,29.99 U1.9 73.55,28.57 73.55,27.85 v73.15,27.45 | U1.36 82.5,25.28 82.5,23.66 82.63,23.53 | 82.63,23.53 C33.2 | v76.1,20.1 75.89,19.89 | 75.89,19.89 75.13,19.13 C32.2 | v82.3,21.1 82.63,21.43 82.63,23.53 | U1.24 75.89,19.89 | U11.10 50.09,23.19 v50.8,23.9 | U1.1 v75.9,34.6 74.85,35.65 69.38,35.65 68.68,36.35
  Top 0.305: U9.2 68.71,37.3 C20.1 68.68,36.35 68.68,33.22 69.65,32.25
  Bottom 0.152: RT1.2 39.45,25.13 42.37,25.13 42.38,25.12 44.41,25.12 44.43,25.1 46.15,25.1
  Bottom 0.254: 76.9,21.3 76.9,20.9 v76.1,20.1 | v82.3,21.1 77.1,21.1 76.9,21.3 | 76.9,21.3 76.61,21.59 76.61,23.66 R31.1 76.86,27.56 81.7,32.4 BOOT0.1 82.5,32.4 81.8,33.1 v81.8,34.1 82.31,34.6 U3.1 82.31,36.3 81.4,37.2 78.5,37.2 77.8,36.5 | v73.15,27.45 71.5,25.8 71.5,24.4 71.05,23.95 50.85,23.95 v50.8,23.9 50.3,23.4 47.85,23.4 46.83,24.43 | 77.8,36.5 77.8,35.6 76.8,34.6 v75.9,34.6 | JP1.1 77.8,42.86 77.8,36.5 | 46.15,25.1 46.83,24.43 | C23.1 46.83,24.62 46.83,24.43
+5V  (via drill 0.35)
  Top 0.254: v73.5,46.6 72.61,46.6 70.36,44.34 C19.1 | J4.2 62.65,8.4 68.6,8.4 70.9,10.7 70.91,10.7 71.64,11.43 73.58,11.43 J3.2
  Top 0.305: C19.1 70.75,43.72 U9.3 | L1.P$2 55.36,44.26 R18.2 56.95,45.85 C5.1 62.62,45.85 C22.+ 68.87,45.83 70.36,44.34
  Bottom 0.254: J3.2 74.43,10.57 74.43,24.88 74.97,25.43 74.97,26.7 74.13,27.55 74.13,27.78 75.09,28.74 75.45,28.74 76.3,29.59 76.3,32.35 73.9,34.75 73.9,46.2 v73.5,46.6
+12V
  Top 0.254: U7.1 63.66,40.12 63.01,39.83 C9.1 63.08,38.07 62.84,38.07 63.24,38.47 63.24,35.38 62.74,34.88 62.74,33.73 62.81,33.66 62.81,31.94 62.1,31.23 U6.12 59.91,31.23 C8.2
AHG
  Top 0.305: R28.1 36.68,37.68 36,37 36,36.02 D5.A 36.03,35.91 Q1.4
ALG
  Top 0.305: Q2.4 43.66,35.91 R20.2 D7.A
APWM  (via drill 0.35)
  Top 0.152: v66.5,31.85 66.53,31.88 U6.6 | U1.30 79.78,23.78 79.37,24.18 79.37,24.98 79,25.35 79,27.1 76,30.1 v75.65,30.1
  Bottom 0.152: v75.65,30.1 73.9,31.85 v66.5,31.85
BHG
  Top 0.305: R27.1 34.22,21.07 | 34.22,21.07 Q3.4 | D4.A 34.78,21.07 34.22,21.07
BLG
  Top 0.305: Q4.4 43.73,21.07 | 43.73,21.07 44.25,21.59 R17.2 | D6.A 44.07,21.07 43.73,21.07
BOOT0  (via drill 0.35)
  Top 0.152: U1.44 80.15,31.2 v81.6,31.2
  Bottom 0.152: v81.6,31.2 82,30.8 83.19,30.8 BOOT0.2
BPWM  (via drill 0.35)
  Top 0.152: U6.3 66.53,29.93 v66.5,29.95 | U1.29 79.4,23.4 78.7,24.1 78.7,25.22 78.69,25.22 78.69,25.8 v75.15,29.35
  Bottom 0.152: v66.5,29.95 74.55,29.95 v75.15,29.35
CAN_H
  Top 0.254: J5.A1 90.57,20.15 90.47,20.25 90.47,20.69 94.14,24.37 94.14,24.55 94.14,33.58 91.84,35.88 J5.B1
  Bottom 0.152: J5.B1 89.43,35.9 88.7,36.63 88.7,40.13 86.83,42.01 85.16,42.01 84.2,42.96 84.2,48.7 83.5,49.4 81.9,49.4 81.02,48.52 U2.7
CAN_L
  Top 0.254: J5.B2 92.27,34.88 93.73,33.42 93.73,24.53 90.06,20.86 J5.A2
  Bottom 0.152: J5.B2 90.02,34.88 88.4,36.5 88.4,40 86.7,41.7 85.03,41.7 83.89,42.84 83.89,48.5 83.3,49.09 82.03,49.09 81.6,48.67 81.6,46.6 81.47,46.47 80.56,46.47 80.43,46.6 80.43,46.91 U2.6
CAN_RX  (via drill 0.35)
  Top 0.152: U1.45 78.44,30.2 v78.1,30.2
  Bottom 0.152: U3.3 79.77,34.46 77.7,32.4 77.7,30.6 v78.1,30.2
CAN_TX  (via drill 0.35)
  Top 0.152: U1.46 79.5,31.96 v79.5,32
  Bottom 0.152: v79.5,32 81.1,33.6 81.1,35.23 81.14,35.26 81.14,35.36 U3.2
DIN_A  (via drill 0.35)
  Top 0.152: J4.3 65.84,12.4 69.4,12.4 74.1,17.1 74.1,17.11 74.39,17.4 74.9,17.4 77.24,19.74 77.24,21.74 v77.3,21.8 | v79.35,29.05 80.07,29.77 U1.42
  Bottom 0.152: v77.3,21.8 77.3,22.98 77.59,23.27 77.59,24.58 77.22,24.95 77.22,26.92 v79.35,29.05
DIN_B
  Top 0.152: U1.31 80.62,23.63 80.62,22.43 80.52,22.33 80.52,22.32 80,21.8 80,20.57 80,20.4 80,18.5 77.7,16.2 77.7,15.1 77.2,14.6 73.8,14.6 70.3,11.1 67.03,11.1 J4.4
ENC_A
  Top 0.152: U1.38 82.19,29 82.7,29 83,28.7 83,24.26 83.76,23.5 83.76,22.96 83,22.2 83,15.49 J3.3
ENC_B
  Top 0.152: J3.4 83.55,13.55 83.6,13.6 84.2,14.2 84.2,23.9 83.6,24.5 83.6,29 83.2,29.4 81.89,29.4 U1.39
GNDA  (via drill 0.35)
  Top 0.152: U11.6 v48.09,24.04 v48.1,24.05
  Top 0.254: U1.47 78.89,32.06 78.89,32.85 79.39,33.35 C31.1 | C33.1 81.49,23.79 82.09,24.39 82.09,24.98 U1.35 | U1.8 71.83,31 C34.1 70.71,32.31 C35.1 | U7.2 66.18,41.7 C10.2 | C8.1 59.56,29.41 60.73,30.57 U6.13 | C32.1 74.53,20.33 75.08,20.88 75.08,21.89 U1.23
  Top 0.305: C7.2 40.73,48.52 U10.4
  Bottom 0.152: v48.1,24.05 48.1,24.85 C23.2
  other vias: 85.8,31.85 81.4,23.7 76.5,16.9 75.7,12.3 75.3,8.1 84.2,7.3 86.5,8.6 84,11.3 88.25,15.65 92,27.9 80.2,33.8 78.9,38.1 83.65,40.9 89.5,37.2 85.1,18.5 83.6,17.8 81,32.7 83.8,37.7 75,47.4 75.9,35.8 78.8,36.1 74.7,32.8 74.9,34.7 82.3,13.4 81.4,9.4 78.7,9 86.1,24.5 88.8,24.6 93.9,18.9 94.5,23.4 93,40.9 81.1,30.4 82.3,27.5 89.4,5.8 88.6,4.4 88.15,13.75 85.9,15.8 85.05,20.05 77.4,12.15 82.8,30 88.25,29.95 85.9,34.9 83.6,21.7 75.15,20.8 81.2,38.6 87.1,39.85 85,43.6 87.05,47.85 84.6,49.4 91,43.6 95.45,36.15 94.55,34.2 94.75,27.45 91.35,12.4 88.75,7.15 76.05,25.5 78.1,25.2 78.25,27.05 76.7,28.6 75.95,26.85 80.15,17.1 80.5,14.2 82.5,8.1
  pour Top (rank 2, no thermals): 0,9.7 0,0 100,0 100,50 33.1,50 33.1,9.9 0,9.9 0,9.8
  pour Bottom (no thermals): 74.5,50 100,50 100,0 74.5,0
GNDIO  (via drill 0.35)
  Top 0.152: R15.1 82.3,16.58 v82.3,19.8
  Top 0.254: C21.1 79.1,42.1 v78.5,41.5 77.7,42.3 77.7,45.4 77.5,45.59 77.5,47.63 C37.2 81.59,48.4 U8.2@1 | 84.05,48.7 82.91,48.7 U8.2@1 | U5.2 82.12,19.98 v82.3,19.8 | U8.2@1 U8.2 | C24.- 89.2,43.73 89.2,46.85 87.35,48.7 C16.2 84.15,48.7 84.05,48.7 | v83.3,47.95 84.05,48.7
  Top 0.61: J5.MH1 90.06,9.34 J5.A8 91.08,14.03 J5.A7 93.7,15.89 | 93.7,15.89 93.7,16.65 92.24,18.11 J5.A3 | 93.7,15.89 95.55,17.74 95.55,34.38 92.17,37.76 92.17,39.22 J5.MH2 90.95,41.92 C24.-
  Bottom 0.254: U3.5 v78.5,41.5 | J5.A7 93.1,15.29 93.1,16.85 | 93.1,16.85 93.1,20.6 90.3,23.4 87.8,23.4 86.57,22.17 86.5,22.17 | U2.2 81.02,44.81 82.3,46.1 82.3,46.95 | 82.3,46.95 82.3,47.58 U2.8 | v82.3,19.8 82.7,19.4 85.5,19.4 86.5,20.4 86.5,22.17 | J5.A9 86.5,22.17 | J5.A3 93.1,16.85 | v83.3,47.95 82.3,46.95
  Bottom 0.61: J5.B8 90.82,28.76 J5.B7 93.25,31.19 93.25,33.25 | 93.25,33.25 92.64,33.86 J5.B3 | 93.25,33.25 93.25,36.4 90.95,38.7 J5.MH2
ISENSEA
  Top 0.152: 71.6,22.73 71.68,22.73 72.35,23.4 | R38.2 70.77,21.9 71.6,22.73 | C38.2 71.6,22.73 | 72.35,23.4 U1.17 | U1.18 73.06,23.4 72.35,23.4
ISENSEB
  Top 0.152: 71.17,25.05 C39.2 69.05,25.05 68.14,24.14 R37.2 | U1.13 71.17,25.05 | 71.17,25.05 71.66,25.05 71.94,24.77 72.3,24.77 U1.15
LED_CAN  (via drill 0.35)
  Top 0.152: U1.40 82.75,30.97 R12.1 82.75,31.38 81.97,32.16 81.97,33.34 82.38,33.75 v86.15,33.75 | v88,33.35 88,32.02 87.55,31.57 R6.2
  Bottom 0.152: v86.15,33.75 87.6,33.75 v88,33.35
LED_GREEN  (via drill 0.35)
  Top 0.152: v84.6,5.7 85.82,4.48 R7.2 | U1.25 78.01,20.61 v77.8,20.4
  Bottom 0.152: v77.8,20.4 77.8,14 83.4,8.4 83.4,6.9 v84.6,5.7
LED_RED  (via drill 0.35)
  Top 0.152: U1.27 79.4,22.02 v79.4,20.4 | v92.4,6.4 93.05,6.4 R9.2
  Bottom 0.152: v79.4,20.4 79.4,14.1 87.1,6.4 v92.4,6.4
LED_YELLOW  (via drill 0.35)
  Top 0.152: R8.2 89.79,4.31 88.5,5.6 v88.1,5.6 | v78.6,20.1 78.6,20.9 78.9,21.2 78.9,21.81 U1.26
  Bottom 0.152: v78.6,20.1 78.6,14.1 87.1,5.6 v88.1,5.6
N$1
  Top 0.305: R29.1 C17.2
N$2
  Top 0.305: R30.1 C18.2
  Top 0.61: C18.2
N$3
  Top 0.305: R3.1 58.79,36.71 60.73,34.77 60.73,34.07 | 60.73,34.07 60,33.34 60,33 60.48,32.52 U6.10 61.66,32.49 62,32.49 62.38,32.87 62.38,33.48 62.1,33.76 62.1,35.6 62.41,35.91 C3.1 | 60.73,34.07 D1.C
N$4
  Top 0.305: C3.2 66.01,35.99 67.38,34.62 U6.8
N$5
  Top 0.305: C4.2 65.5,26.51 R5.1 61.99,26.51 D2.C 62.75,28.23 62.75,28.9 62.38,29.27 U6.15
N$6
  Top 0.152: R4.2 85.2,36.85 J5.B10
N$7
  Top 0.152: J5.B9 86.8,37.62 86.8,22.96 J5.A10
N$8
  Top 0.305: C4.1 67.3,26.5 67.38,26.43 U6.1
N$9
  Top 0.152: R7.1 87.52,2.28 LED1.A
N$10
  Top 0.152: R8.1 92.13,2.28 LED2.A
N$11
  Top 0.152: R9.1 96.74,2.28 LED3.A
N$12
  Top 0.152: R6.1 85.24,7.61 J5.A12
N$13
  Top 0.152: R12.2 86.25,29.25 86.25,26.47 J5.B12
N$14
  Bottom 0.152: U3.7 81.03,40.86 82.28,42.11 U2.1
N$15
  Top 0.254: C24.+ 85.65,44.68 C16.1 85.6,46.95 84.55,46.95 83.6,46 U8.3
  Top 0.61: J5.A5 91.08,16.07 J5.A4 88.8,18.35 88.8,22.05 93.15,26.4 93.15,30.51 J5.B5 91.08,31.82 J5.B4 88.1,34.8 88.1,42.23 C24.+
N$16
  Bottom 0.152: U3.6 79.77,41.03 78.47,42.33 U2.4
N$17  (via drill 0.35)
  Top 0.152: U5.1 80.93,16.91 R15.2 80.96,14.7 v81.4,14.7
  Top 0.254: J5.B6 88.05,28.79 88.05,17.06 J5.A6
  Bottom 0.152: v81.4,14.7 89.71,14.7 J5.A6
N$18
  Top 0.305: R14.1 C14.2
N$19  (via drill 0.3)
  Top 0.305: R17.1 44.95,25.6 45.25,25.6 | 45.25,25.6 D6.C | v46.15,27.9 45.25,27 45.25,25.6 | U6.14 61.08,29.93 v60.7,29.55
  Bottom 0.305: v46.15,27.9 59.05,27.9 v60.7,29.55
N$20
  Top 0.305: R13.1 C13.2
N$21
  Top 0.305: R20.1 46.25,36.8 D7.C 46.38,37.78 56.91,37.78 57.4,37.3 57.4,34.8 60.35,31.85 61.6,31.85 U6.11
N$22
  Top 0.152: U11.3 49.09,28.09 50,29 50,31 49.5,31.5 R1.6
N$23
  Top 0.152: U11.7 48.59,21.81 49.9,20.5 49.9,18.9 49.66,18.66 R2.5
N$24
  Top 0.152: U5.3 77.7,18 76.4,18 75.17,16.77 U4.2
N$25
  Top 0.152: U4.1 76.11,15.49 R16.2
N$26
  Top 0.305: U10.2 46.77,44.26 D3.C 49.09,44.23 L1.P$1
N$27
  Top 0.305: U10.3 44.9,45.52 C6.1
N$28
  Top 0.152: R18.1 R19.2 53.34,49.5 38.47,49.5 38.25,49.28 38.25,47.79 U10.5
N$29
  Top 0.152: R2.6 51.34,18.66 50.3,19.7 50.3,20.62 49.09,21.84 U11.8
N$30
  Top 0.305: R11.2 36.6,43.5 | 36.6,43.5 36.74,43.5 U10.8 U10.1 | U10.7 37.26,44.16 36.6,43.5
N$31
  Top 0.152: R1.5 51.5,31.5 50.93,30.93 50.92,30.93 50.59,30.59 50.59,29 49.59,28 U11.2
N$32  (via drill 0.35)
  Top 0.305: U6.16 61.6,28.6 61,28.6 60.4,28 v60.3,28 | v44.1,25.95 44.1,26 38,26 36.7,24.7 D4.C 34.56,24.7 R27.2
  Bottom 0.305: v60.3,28 59.3,27 45.15,27 v44.1,25.95
N$33
  Top 0.305: R28.2 38.4,38 40.54,38 | D5.C 40.54,38 | 40.54,38 40.89,38.35 58.27,38.35 61.62,35 U6.9
N$34
  Top 0.152: U1.5 74,30.95 74,31.2 75.4,32.6 75.4,33.23 U12.1
N$35
  Top 0.152: U1.6 72.85,31.39 U12.3
OPOUTA  (via drill 0.35)
  Top 0.152: v49.6,24.2 v49.59,24.2 U11.9 | v64.8,24.7 64.9,24.7 65.4,24.2 65.4,22.8 66.12,22.08 R38.1
  Bottom 0.152: v64.8,24.7 50.1,24.7 v49.6,24.2
OPOUTB  (via drill 0.3, 0.35)
  Top 0.152: v50.7,26.3 50.09,26.91 U11.1 | v65.7,25.35 66.2,24.85 R37.1
  Bottom 0.152: v50.7,26.3 51.65,25.35 v65.7,25.35
OUT+  (via drill 0.35)
  Top 0.305: Q2.8 38,30.18 38,28.72 R29.2 | v56.5,35.6 R3.2
  other vias: 38,34 39,34 40,34 41,34 42,34 42,33 41,33 40,33 39,33 38,33 38,32 39,32 40,32 41,32 42,32 42,31 41,31 40,31 39,31 38,31 38,30 39,30 40,30 41,30 42,30
  pour Bottom (no thermals): 0,25.2 74.1,25.2 74.1,50 0,50
  pour Top (no thermals): 33.4,25.2 42.6,25.2 42.6,34.8 36.4,34.8 36.3,34.7 36.3,33.6 36.1,33.4 33.4,33.4
OUT-  (via drill 0.35)
  Top 0.305: R30.2 37.43,21.57 Q4.5 | R5.2 63.4,23.4 62.35,22.35 v62.35,22.3 | Q3.3 33.86,19.75 33.05,20.56 33.05,22.95 C14.1
  other vias: 38,21 39,21 40,21 41,21 42,21 42,20 41,20 40,20 39,20 38,20 38,19 39,19 40,19 41,19 42,19 42,18 41,18 40,18 39,18 38,18 38,17 39,17 40,17 41,17 42,17
  pour Bottom: 0,0 0,24.8 74.1,24.8 74.1,0
  pour Top (no thermals): 33.4,20.5 33.4,16.3 42.6,16.3 42.6,21.6 35.2,21.6 35.2,20.5
SWCLK
  Top 0.152: U1.37 81.1,27.2 80.3,27.2 77.2,30.3 77.2,35 78.1,35.9 78.1,38.28 76.51,39.87 JP1.3
SWDIO
  Top 0.152: U1.34 80.69,25.67 80.69,26.27 80.17,26.8 80.15,26.8 76.7,30.25 76.7,35.66 77.46,36.42 77.46,37.74 76.82,38.38 74.84,38.38 73.96,39.26 73.96,40.66 JP1.2
TEMP  (via drill 0.35)
  Top 0.152: U1.11 71.71,29 v71.5,29
  Bottom 0.152: RT1.1 39.25,24.52 39.55,24.82 44.28,24.82 46.1,23 72.45,23 R10.2 73.65,26.2 C15.2 73.71,26.74 73.71,27.68 73.34,28.05 71.3,28.05 71.05,28.3 71.05,28.6 71.45,29 v71.5,29
USB_DM  (via drill 0.35)
  Top 0.152: U1.32 80.39,24.46 79.5,25.35 79.5,26.45 v79.6,26.55
  Bottom 0.152: v79.6,26.55 79.61,26.55 79.72,26.66 82.42,26.66 84.67,28.91 86.95,28.91 89.38,26.48 90.68,26.48 D8.4 90.7,26.2 91.33,25.58 93.66,25.58 93.65,25.57 95.68,25.57 J6.2
USB_DP  (via drill 0.35)
  Top 0.152: U1.33 80.1,25.56 v80.1,25.85
  Bottom 0.152: J6.3 95.78,25.22 91.34,25.22 D8.3 86.69,28.6 84.8,28.6 82.5,26.3 80.4,26.3 80.1,26 v80.1,25.85 80.1,25.45 R31.2
VCC
  Top 0.254: C10.1 66.06,43.2 U7.3 59.1,43.2 58.56,43.74 R40.2 57.71,43.64 57.64,43.64 56.85,42.85 56.85,38.95 49.51,38.95 C12.2
  Top 0.305: C7.1 39.03,46.53 37.9,45.4 37.38,45.4 U10.6 37.23,45.5 33.58,45.5 R11.1
  Top 0.813: C12.2 32.48,39.48 30.85,37.85 Q1.9
  pour Top (no thermals): 0,10 44.7,10 44.7,15.9 33,15.9 33,50 0,50
VCSA
  Top 0.305: Q2.1 44.1,29.77 C17.1
  pour Top (no thermals): 43,33.3 45.7,33.3 45.7,33.5 49.5,33.5 49.5,29.4 43,29.4
VCSB
  Top 0.305: 47.17,16.83 47,17 | Q4.3 43.37,19.75 42.63,20.49 42.63,22.87 42.16,23.35 C18.1
  pour Top (no thermals): 43,20.4 43,16.3 49.5,16.3 49.5,20.7 44.5,20.7 44.5,20.4
VSENSE
  Top 0.152: R40.1 57.71,41.3 | 57.71,41.3 R39.2 | U1.10 71.81,29.6 71.3,29.6 70.6,28.9 70.4,28.9 69.6,29.7 69.6,31.2 69.38,31.42 68.12,32.67 68.12,36.08 67.18,37.02 66.8,37.02 | 57.71,41.3 58.43,41.3 59.36,40.37 61.96,40.37 62.52,40.93 64.43,40.93 64.8,40.55 64.8,39.8 63.9,38.9 63.9,37.6 64.5,37 66.78,37 66.8,37.02 | 66.8,37.02 C30.2

### Text on the board
tPlace: ver1.2 | C:/Users/ryuni/Desktop/python_workspace/image_th.bmp | C:/Users/ryuni/Desktop/python_workspace/image_th.bmp
bPlace: 3V3 | SWDIO | SWCLK | GND | 1 | 0 | GND | 5V | DIN_A | DIN_B | GND | 5V | ENC_A | ENC_B